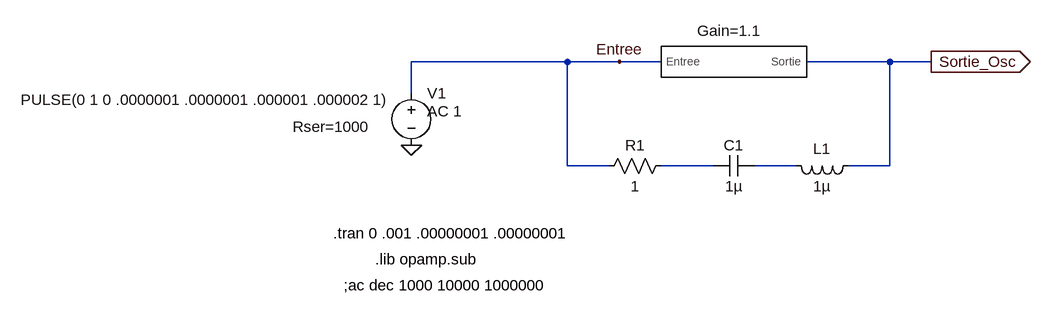
[diagram p0: schematic Oscillateur_Bloc.asc]
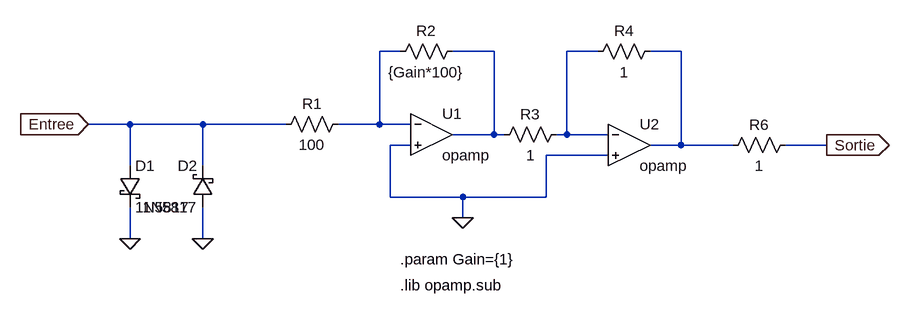
[diagram p1: sub-circuit bloc_gain.asc]
Oscillateur_Bloc.asc, the LTspice schematic file:
Version 4
SHEET 1 880 680
WIRE -112 192 -352 192
WIRE -32 192 -112 192
WIRE 32 192 -32 192
WIRE 384 192 256 192
WIRE 448 192 384 192
WIRE -352 240 -352 192
WIRE -112 352 -112 192
WIRE -48 352 -112 352
WIRE 112 352 32 352
WIRE 240 352 176 352
WIRE 384 352 384 192
WIRE 384 352 320 352
FLAG 448 192 Sortie_Osc
IOPIN 448 192 Out
FLAG -352 320 0
FLAG -32 192 Entree
SYMBOL voltage -352 224 R0
WINDOW 123 24 44 Left 2
WINDOW 39 -183 68 Left 2
WINDOW 3 -601 26 Left 2
SYMATTR Value2 AC 1
SYMATTR SpiceLine Rser=1000
SYMATTR Value PULSE(0 1 0 .0000001 .0000001 .000001 .000002 1)
SYMATTR InstName V1
SYMBOL ind 336 336 R90
WINDOW 0 5 56 VBottom 2
WINDOW 3 32 56 VTop 2
SYMATTR InstName L1
SYMATTR Value 1µ
SYMBOL cap 176 336 R90
WINDOW 0 0 32 VBottom 2
WINDOW 3 32 32 VTop 2
SYMATTR InstName C1
SYMATTR Value 1µ
SYMBOL res -64 368 R270
WINDOW 0 32 56 VTop 2
WINDOW 3 0 56 VBottom 2
SYMATTR InstName R1
SYMATTR Value 1
SYMBOL Bloc_Gain 144 192 R0
WINDOW 0 0 -24 Invisible 2
WINDOW 39 -7 -32 Bottom 2
SYMATTR InstName X1
SYMATTR SpiceLine Gain=1.1
TEXT -472 456 Left 2 !.tran 0 .001 .00000001 .00000001
TEXT -408 496 Left 2 !.lib opamp.sub
TEXT -456 536 Left 2 !;ac dec 1000 10000 1000000

bloc_gain.asc, the sub-circuit schematic file:
Version 4
SHEET 1 1200 680
WIRE 352 0 320 0
WIRE 496 0 432 0
WIRE 656 0 608 0
WIRE 784 0 736 0
WIRE -64 112 -128 112
WIRE 48 112 -64 112
WIRE 176 112 48 112
WIRE 320 112 320 0
WIRE 320 112 256 112
WIRE 368 112 320 112
WIRE 496 128 496 0
WIRE 496 128 432 128
WIRE 512 128 496 128
WIRE 608 128 608 0
WIRE 608 128 592 128
WIRE 672 128 608 128
WIRE 368 144 336 144
WIRE 784 144 784 0
WIRE 784 144 736 144
WIRE 864 144 784 144
WIRE 1008 144 944 144
WIRE 672 160 576 160
WIRE -64 176 -64 112
WIRE 48 176 48 112
WIRE 336 224 336 144
WIRE 448 224 336 224
WIRE 576 224 576 160
WIRE 576 224 448 224
WIRE 448 256 448 224
WIRE -64 288 -64 240
WIRE 48 288 48 240
FLAG -128 112 Entree
IOPIN -128 112 In
FLAG 1008 144 Sortie
IOPIN 1008 144 Out
FLAG 448 256 0
FLAG 48 288 0
FLAG -64 288 0
SYMBOL Opamps\\opamp 400 64 R0
SYMATTR InstName U1
SYMBOL res 272 96 R90
WINDOW 0 0 56 VBottom 2
WINDOW 3 32 56 VTop 2
SYMATTR InstName R1
SYMATTR Value 100
SYMBOL res 448 -16 R90
WINDOW 0 0 56 VBottom 2
WINDOW 3 32 56 VTop 2
SYMATTR InstName R2
SYMATTR Value {Gain*100}
SYMBOL Opamps\\opamp 704 80 R0
SYMATTR InstName U2
SYMBOL res 608 112 R90
WINDOW 0 0 56 VBottom 2
WINDOW 3 32 56 VTop 2
SYMATTR InstName R3
SYMATTR Value 1
SYMBOL res 752 -16 R90
WINDOW 0 0 56 VBottom 2
WINDOW 3 32 56 VTop 2
SYMATTR InstName R4
SYMATTR Value 1
SYMBOL res 960 128 R90
WINDOW 0 0 56 VBottom 2
WINDOW 3 32 56 VTop 2
SYMATTR InstName R6
SYMATTR Value 1
SYMBOL schottky -80 176 R0
SYMATTR InstName D1
SYMATTR Value 1N5817
SYMATTR Description Diode
SYMATTR Type diode
SYMBOL schottky 64 240 R180
WINDOW 0 24 64 Left 2
WINDOW 3 24 0 Left 2
SYMATTR InstName D2
SYMATTR Value 1N5817
SYMATTR Description Diode
SYMATTR Type diode
TEXT 352 360 Left 2 !.lib opamp.sub
TEXT 352 320 Left 2 !.param Gain={1}

The netlist it stands for:
* Oscillateur_Bloc.asc
V1 Entree 0 PULSE(0 1 0 .0000001 .0000001 .000001 .000002 1) AC 1 Rser=1000
L1 Sortie_Osc N002 1µ
C1 N002 N001 1µ
R1 Entree N001 1
XX1 Entree Sortie_Osc bloc_gain params: Gain=1.1

* block symbol definitions
.subckt bloc_gain Entree Sortie
XU1 N001 0 N002 opamp Aol=100K GBW=10Meg  ; pins invin noninvin out
R1 N001 Entree 100
R2 N002 N001 {Gain*100}
XU2 N003 0 N004 opamp Aol=100K GBW=10Meg  ; pins invin noninvin out
R3 N003 N002 1
R4 N004 N003 1
R6 Sortie N004 1
D1 Entree 0 1N5817
D2 0 Entree 1N5817
.lib opamp.sub
.param Gain={1}
.ends bloc_gain

.model D D
.lib standard.dio
.tran 0 .001 .00000001 .00000001
.lib opamp.sub
;ac dec 1000 10000 1000000
.backanno
.end